# EasyEDA Pro project ProProject_nRF52840无线键盘_2024-02-15.epro, schematic Keys_JLC

## Sheets
1 Keys_JLC
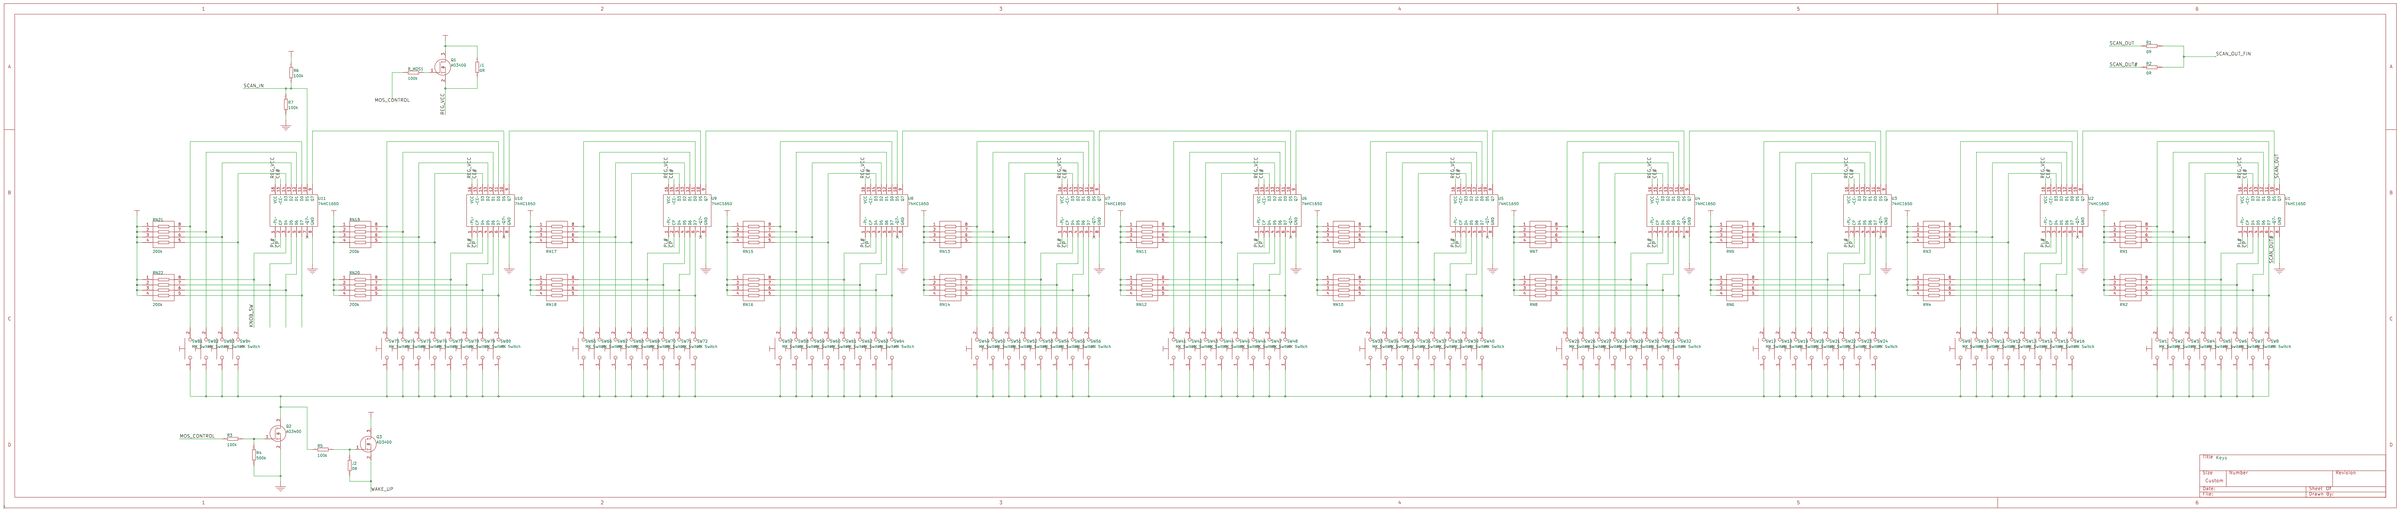
[diagram p6: Keys_JLC]
2 LEDs_JLC
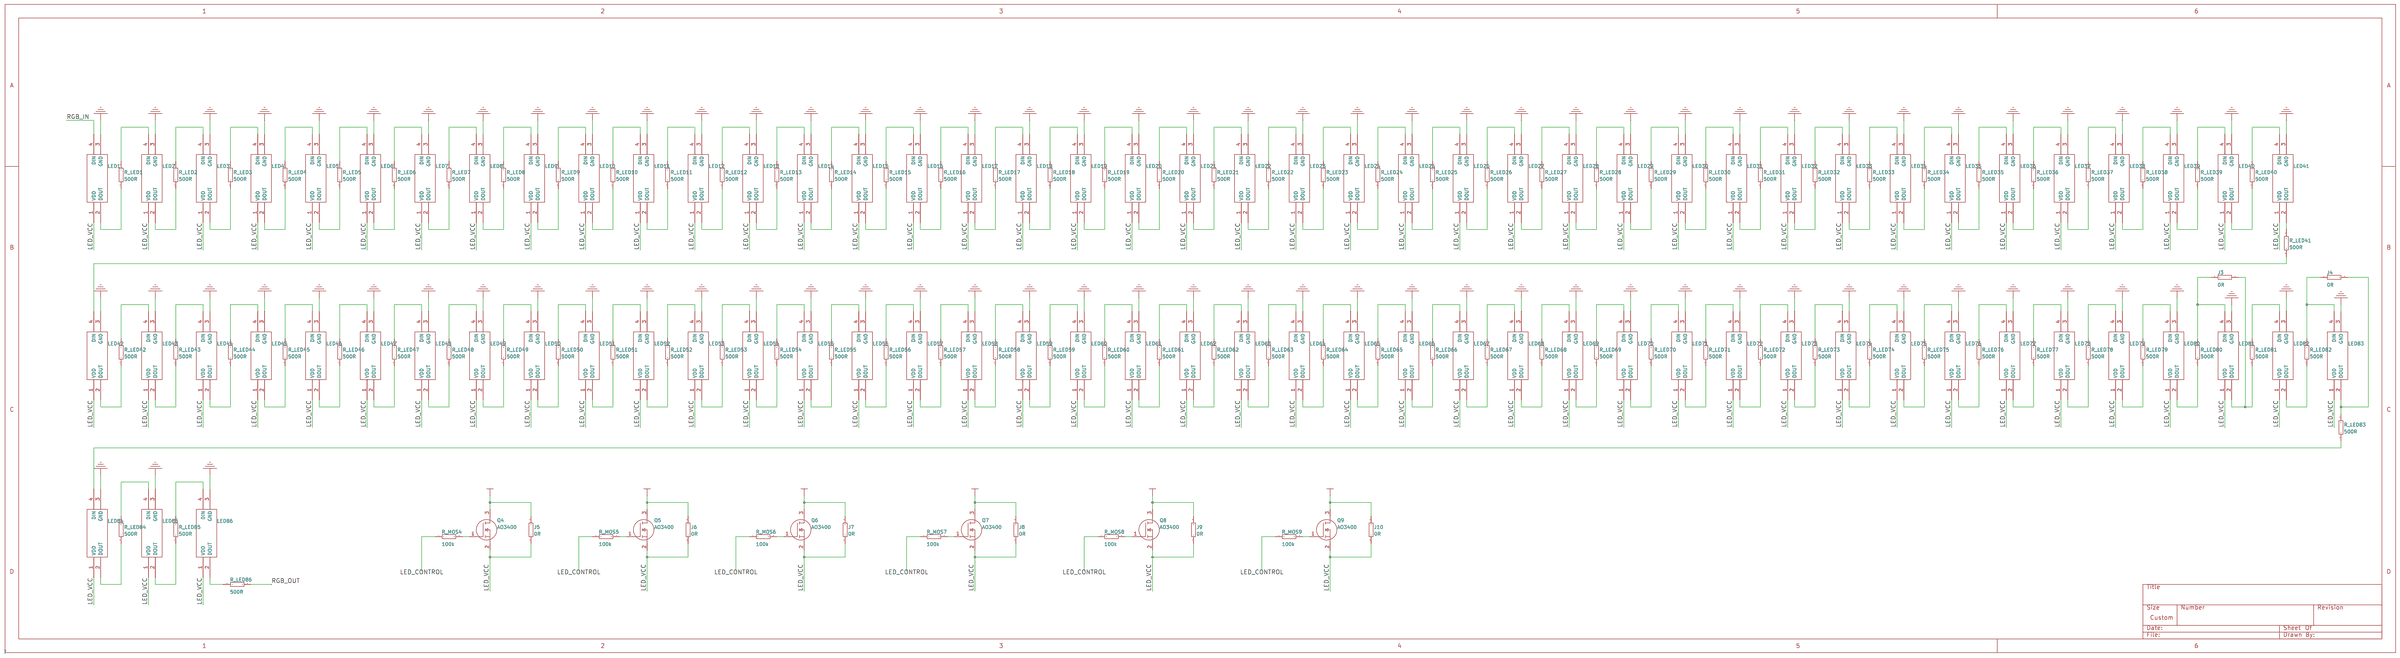
[diagram p7: LEDs_JLC]
3 Other_JLC
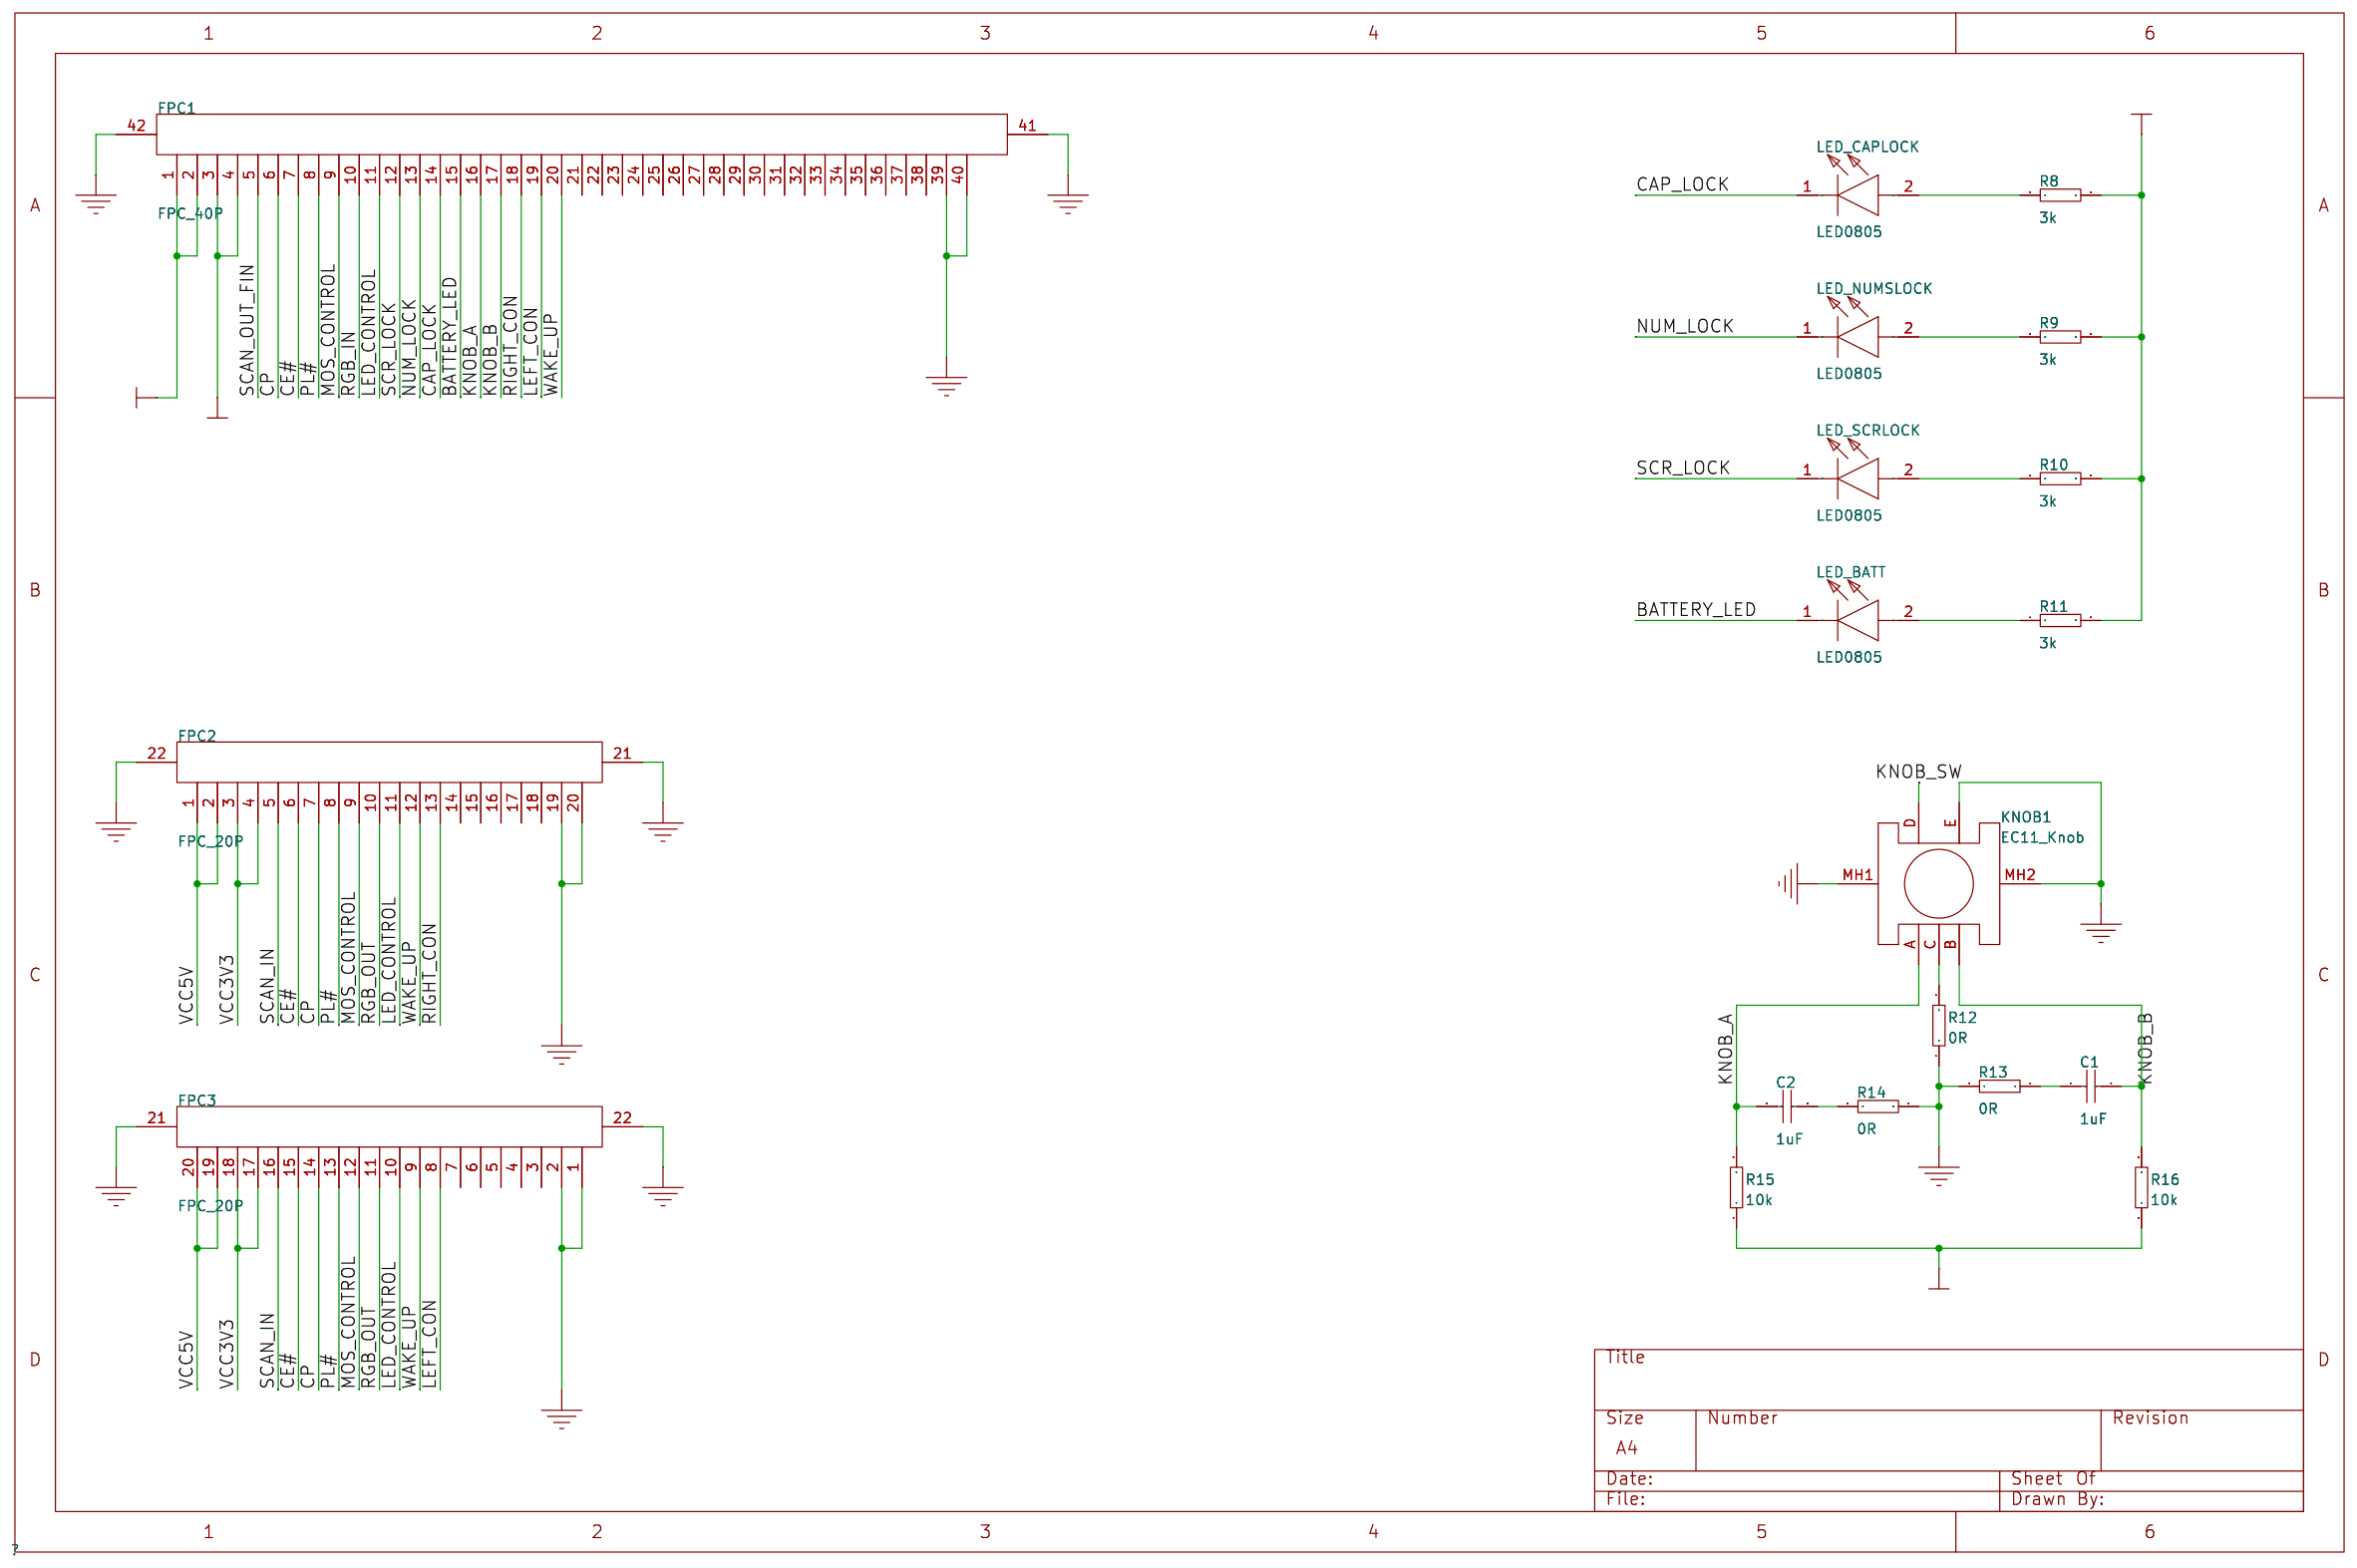
[diagram p8: Other_JLC]

## Parts
sheet Keys_JLC
J1  0R  [0805]
J2  0R  [0805]
Q1  AO3400  [SOT-23-3]
Q2  AO3400  [SOT-23-3]
Q3  AO3400  [SOT-23-3]
R1  0R  [0805]
R2  0R  [0805]
R3  100k  [0805]
R4  500k  [0805]
R5  100k  [0805]
R6  100k  [0805]
R7  100k  [0805]
R_MOS1  100k  [0805]
RN1  排阻  [0603排阻]
RN2  排阻  [0603排阻]
RN3  排阻  [0603排阻]
RN4  排阻  [0603排阻]
RN5  排阻  [0603排阻]
RN6  排阻  [0603排阻]
RN7  排阻  [0603排阻]
RN8  排阻  [0603排阻]
RN9  排阻  [0603排阻]
RN10  排阻  [0603排阻]
RN11  排阻  [0603排阻]
RN12  排阻  [0603排阻]
RN13  排阻  [0603排阻]
RN14  排阻  [0603排阻]
RN15  排阻  [0603排阻]
RN16  排阻  [0603排阻]
RN17  排阻  [0603排阻]
RN18  排阻  [0603排阻]
RN19  200k  [0603排阻]
RN20  200k  [0603排阻]
RN21  200k  [0603排阻]
RN22  200k  [0603排阻]
SW1  MX Switch  [MX-Switch]
SW2  MX Switch  [MX-Switch]
SW3  MX Switch  [MX-Switch]
SW4  MX Switch  [MX-Switch]
SW5  MX Switch  [MX-Switch]
SW6  MX Switch  [MX-Switch]
SW7  MX Switch  [MX-Switch]
SW8  MX Switch  [MX-Switch]
SW9  MX Switch  [MX-Switch]
SW10  MX Switch  [MX-Switch]
SW11  MX Switch  [MX-Switch]
SW12  MX Switch  [MX-Switch]
SW13  MX Switch  [MX-Switch]
SW14  MX Switch  [MX-Switch]
SW15  MX Switch  [MX-Switch]
SW16  MX Switch  [MX-Switch]
SW17  MX Switch  [MX-Switch]
SW18  MX Switch  [MX-Switch]
SW19  MX Switch  [MX-Switch]
SW20  MX Switch  [MX-Switch]
SW21  MX Switch  [MX-Switch]
SW22  MX Switch  [MX-Switch]
SW23  MX Switch  [MX-Switch]
SW24  MX Switch  [MX-Switch]
SW25  MX Switch  [MX-Switch]
SW26  MX Switch  [MX-Switch]
SW27  MX Switch  [MX-Switch]
SW28  MX Switch  [MX-Switch]
SW29  MX Switch  [MX-Switch]
SW30  MX Switch  [MX-Switch]
SW31  MX Switch  [MX-Switch]
SW32  MX Switch  [MX-Switch]
SW33  MX Switch  [MX-Switch]
SW34  MX Switch  [MX-Switch]
SW35  MX Switch  [MX-Switch]
SW36  MX Switch  [MX-Switch]
SW37  MX Switch  [MX-Switch]
SW38  MX Switch  [MX-Switch]
SW39  MX Switch  [MX-Switch]
SW40  MX Switch  [MX-Switch]
SW41  MX Switch  [MX-Switch]
SW42  MX Switch  [MX-Switch]
SW43  MX Switch  [MX-Switch]
SW44  MX Switch  [MX-Switch]
SW45  MX Switch  [MX-Switch]
SW46  MX Switch  [MX-Switch]
SW47  MX Switch  [MX-Switch]
SW48  MX Switch  [MX-Switch]
SW49  MX Switch  [MX-Switch]
SW50  MX Switch  [MX-Switch]
SW51  MX Switch  [MX-Switch]
SW52  MX Switch  [MX-Switch]
SW53  MX Switch  [MX-Switch]
SW54  MX Switch  [MX-Switch]
SW55  MX Switch  [MX-Switch]
SW56  MX Switch  [MX-Switch]
SW57  MX Switch  [MX-Switch]
SW58  MX Switch  [MX-Switch]
SW59  MX Switch  [MX-Switch]
SW60  MX Switch  [MX-Switch]
SW61  MX Switch  [MX-Switch]
SW62  MX Switch  [MX-Switch]
SW63  MX Switch  [MX-Switch]
SW64  MX Switch  [MX-Switch]
SW65  MX Switch  [MX-Switch]
SW66  MX Switch  [MX-Switch]
SW67  MX Switch  [MX-Switch]
SW68  MX Switch  [MX-Switch]
SW69  MX Switch  [MX-Switch]
SW70  MX Switch  [MX-Switch]
SW71  MX Switch  [MX-Switch]
SW72  MX Switch  [MX-Switch]
SW73  MX Switch  [MX-Switch]
SW74  MX Switch  [MX-Switch]
SW75  MX Switch  [MX-Switch]
SW76  MX Switch  [MX-Switch]
SW77  MX Switch  [MX-Switch]
SW78  MX Switch  [MX-Switch]
SW79  MX Switch  [MX-Switch]
SW80  MX Switch  [MX-Switch]
SW81  MX Switch  [MX-Switch]
SW82  MX Switch  [MX-Switch]
SW83  MX Switch  [MX-Switch]
SW84  MX Switch  [MX-Switch]
U1  74HC165D  [SOIC-16]
U2  74HC165D  [SOIC-16]
U3  74HC165D  [SOIC-16]
U4  74HC165D  [SOIC-16]
U5  74HC165D  [SOIC-16]
U6  74HC165D  [SOIC-16]
U7  74HC165D  [SOIC-16]
U8  74HC165D  [SOIC-16]
U9  74HC165D  [SOIC-16]
U10  74HC165D  [SOIC-16]
U11  74HC165D  [SOIC-16]
sheet LEDs_JLC
J3  0R  [0805]
J4  0R  [0805]
J5  0R  [0805]
J6  0R  [0805]
J7  0R  [0805]
J8  0R  [0805]
J9  0R  [0805]
J10  0R  [0805]
LED1  WS2812_3528LED  [WS2812_3528LED]
LED2  WS2812_3528LED  [WS2812_3528LED]
LED3  WS2812_3528LED  [WS2812_3528LED]
LED4  WS2812_3528LED  [WS2812_3528LED]
LED5  WS2812_3528LED  [WS2812_3528LED]
LED6  WS2812_3528LED  [WS2812_3528LED]
LED7  WS2812_3528LED  [WS2812_3528LED]
LED8  WS2812_3528LED  [WS2812_3528LED]
LED9  WS2812_3528LED  [WS2812_3528LED]
LED10  WS2812_3528LED  [WS2812_3528LED]
LED11  WS2812_3528LED  [WS2812_3528LED]
LED12  WS2812_3528LED  [WS2812_3528LED]
LED13  WS2812_3528LED  [WS2812_3528LED]
LED14  WS2812_3528LED  [WS2812_3528LED]
LED15  WS2812_3528LED  [WS2812_3528LED]
LED16  WS2812_3528LED  [WS2812_3528LED]
LED17  WS2812_3528LED  [WS2812_3528LED]
LED18  WS2812_3528LED  [WS2812_3528LED]
LED19  WS2812_3528LED  [WS2812_3528LED]
LED20  WS2812_3528LED  [WS2812_3528LED]
LED21  WS2812_3528LED  [WS2812_3528LED]
LED22  WS2812_3528LED  [WS2812_3528LED]
LED23  WS2812_3528LED  [WS2812_3528LED]
LED24  WS2812_3528LED  [WS2812_3528LED]
LED25  WS2812_3528LED  [WS2812_3528LED]
LED26  WS2812_3528LED  [WS2812_3528LED]
LED27  WS2812_3528LED  [WS2812_3528LED]
LED28  WS2812_3528LED  [WS2812_3528LED]
LED29  WS2812_3528LED  [WS2812_3528LED]
LED30  WS2812_3528LED  [WS2812_3528LED]
LED31  WS2812_3528LED  [WS2812_3528LED]
LED32  WS2812_3528LED  [WS2812_3528LED]
LED33  WS2812_3528LED  [WS2812_3528LED]
LED34  WS2812_3528LED  [WS2812_3528LED]
LED35  WS2812_3528LED  [WS2812_3528LED]
LED36  WS2812_3528LED  [WS2812_3528LED]
LED37  WS2812_3528LED  [WS2812_3528LED]
LED38  WS2812_3528LED  [WS2812_3528LED]
LED39  WS2812_3528LED  [WS2812_3528LED]
LED40  WS2812_3528LED  [WS2812_3528LED]
LED41  WS2812_3528LED  [WS2812_3528LED]
LED42  WS2812_3528LED  [WS2812_3528LED]
LED43  WS2812_3528LED  [WS2812_3528LED]
LED44  WS2812_3528LED  [WS2812_3528LED]
LED45  WS2812_3528LED  [WS2812_3528LED]
LED46  WS2812_3528LED  [WS2812_3528LED]
LED47  WS2812_3528LED  [WS2812_3528LED]
LED48  WS2812_3528LED  [WS2812_3528LED]
LED49  WS2812_3528LED  [WS2812_3528LED]
LED50  WS2812_3528LED  [WS2812_3528LED]
LED51  WS2812_3528LED  [WS2812_3528LED]
LED52  WS2812_3528LED  [WS2812_3528LED]
LED53  WS2812_3528LED  [WS2812_3528LED]
LED54  WS2812_3528LED  [WS2812_3528LED]
LED55  WS2812_3528LED  [WS2812_3528LED]
LED56  WS2812_3528LED  [WS2812_3528LED]
LED57  WS2812_3528LED  [WS2812_3528LED]
LED58  WS2812_3528LED  [WS2812_3528LED]
LED59  WS2812_3528LED  [WS2812_3528LED]
LED60  WS2812_3528LED  [WS2812_3528LED]
LED61  WS2812_3528LED  [WS2812_3528LED]
LED62  WS2812_3528LED  [WS2812_3528LED]
LED63  WS2812_3528LED  [WS2812_3528LED]
LED64  WS2812_3528LED  [WS2812_3528LED]
LED65  WS2812_3528LED  [WS2812_3528LED]
LED66  WS2812_3528LED  [WS2812_3528LED]
LED67  WS2812_3528LED  [WS2812_3528LED]
LED68  WS2812_3528LED  [WS2812_3528LED]
LED69  WS2812_3528LED  [WS2812_3528LED]
LED70  WS2812_3528LED  [WS2812_3528LED]
LED71  WS2812_3528LED  [WS2812_3528LED]
LED72  WS2812_3528LED  [WS2812_3528LED]
LED73  WS2812_3528LED  [WS2812_3528LED]
LED74  WS2812_3528LED  [WS2812_3528LED]
LED75  WS2812_3528LED  [WS2812_3528LED]
LED76  WS2812_3528LED  [WS2812_3528LED]
LED77  WS2812_3528LED  [WS2812_3528LED]
LED78  WS2812_3528LED  [WS2812_3528LED]
LED79  WS2812_3528LED  [WS2812_3528LED]
LED80  WS2812_3528LED  [WS2812_3528LED]
LED81  WS2812_3528LED  [WS2812_3528LED]
LED82  WS2812_3528LED  [WS2812_3528LED]
LED83  WS2812_3528LED  [WS2812_3528LED]
LED84  WS2812_3528LED  [WS2812_3528LED]
LED85  WS2812_3528LED  [WS2812_3528LED]
LED86  WS2812_3528LED  [WS2812_3528LED]
Q4  AO3400  [SOT-23-3]
Q5  AO3400  [SOT-23-3]
Q6  AO3400  [SOT-23-3]
Q7  AO3400  [SOT-23-3]
Q8  AO3400  [SOT-23-3]
Q9  AO3400  [SOT-23-3]
R_LED1  500R  [0805]
R_LED2  500R  [0805]
R_LED3  500R  [0805]
R_LED4  500R  [0805]
R_LED5  500R  [0805]
R_LED6  500R  [0805]
R_LED7  500R  [0805]
R_LED8  500R  [0805]
R_LED9  500R  [0805]
R_LED10  500R  [0805]
R_LED11  500R  [0805]
R_LED12  500R  [0805]
R_LED13  500R  [0805]
R_LED14  500R  [0805]
R_LED15  500R  [0805]
R_LED16  500R  [0805]
R_LED17  500R  [0805]
R_LED18  500R  [0805]
R_LED19  500R  [0805]
R_LED20  500R  [0805]
R_LED21  500R  [0805]
R_LED22  500R  [0805]
R_LED23  500R  [0805]
R_LED24  500R  [0805]
R_LED25  500R  [0805]
R_LED26  500R  [0805]
R_LED27  500R  [0805]
R_LED28  500R  [0805]
R_LED29  500R  [0805]
R_LED30  500R  [0805]
R_LED31  500R  [0805]
R_LED32  500R  [0805]
R_LED33  500R  [0805]
R_LED34  500R  [0805]
R_LED35  500R  [0805]
R_LED36  500R  [0805]
R_LED37  500R  [0805]
R_LED38  500R  [0805]
R_LED39  500R  [0805]
R_LED40  500R  [0805]
R_LED41  500R  [0805]
R_LED42  500R  [0805]
R_LED43  500R  [0805]
R_LED44  500R  [0805]
R_LED45  500R  [0805]
R_LED46  500R  [0805]
R_LED47  500R  [0805]
R_LED48  500R  [0805]
R_LED49  500R  [0805]
R_LED50  500R  [0805]
R_LED51  500R  [0805]
R_LED52  500R  [0805]
R_LED53  500R  [0805]
R_LED54  500R  [0805]
R_LED55  500R  [0805]
R_LED56  500R  [0805]
R_LED57  500R  [0805]
R_LED58  500R  [0805]
R_LED59  500R  [0805]
R_LED60  500R  [0805]
R_LED61  500R  [0805]
R_LED62  500R  [0805]
R_LED63  500R  [0805]
R_LED64  500R  [0805]
R_LED65  500R  [0805]
R_LED66  500R  [0805]
R_LED67  500R  [0805]
R_LED68  500R  [0805]
R_LED69  500R  [0805]
R_LED70  500R  [0805]
R_LED71  500R  [0805]
R_LED72  500R  [0805]
R_LED73  500R  [0805]
R_LED74  500R  [0805]
R_LED75  500R  [0805]
R_LED76  500R  [0805]
R_LED77  500R  [0805]
R_LED78  500R  [0805]
R_LED79  500R  [0805]
R_LED80  500R  [0805]
R_LED81  500R  [0805]
R_LED82  500R  [0805]
R_LED83  500R  [0805]
R_LED84  500R  [0805]
R_LED85  500R  [0805]
R_LED86  500R  [0805]
R_MOS4  100k  [0805]
R_MOS5  100k  [0805]
R_MOS6  100k  [0805]
R_MOS7  100k  [0805]
R_MOS8  100k  [0805]
R_MOS9  100k  [0805]
sheet Other_JLC
C1  1uF  [0805]
C2  1uF  [0805]
FPC1  FPC_40P  [FPC_40P]
FPC2  FPC_20P  [FPC_20P]
FPC3  FPC_20P  [FPC_20P]
KNOB1  EC11_Knob  [EC11]
LED_BATT  LED0805  [LED0805]
LED_CAPLOCK  LED0805  [LED0805]
LED_NUMSLOCK  LED0805  [LED0805]
LED_SCRLOCK  LED0805  [LED0805]
R8  3k  [0805]
R9  3k  [0805]
R10  3k  [0805]
R11  3k  [0805]
R12  0R  [0805]
R13  0R  [0805]
R14  0R  [0805]
R15  10k  [0805]
R16  10k  [0805]

## Library data of the parts
J1-J10 R1-R16 R_LED1-R_LED86 R_MOS1 R_MOS4-R_MOS9 = Resistor: Library Name: Brian_Integrated_Lib
Q1-Q9 = AO3400: MOSFET (N-Channel); Datasheet Link: https://www.infineon.com/dgdl/irlml6344pbf.pdf?fileId=5546d462533600a4015356689c44262c; Height: 1.12mm; Manufacturer_Name: Infineon; Manufacturer_Part_Number: IRLML6344TRPBF; Mouser Part Number: 942-IRLML6344TRPBF; Mouser Price/Stock: https://www.mouser.co.uk/ProductDetail/Infineon-Technologies/IRLML6344TRPBF?qs=9%252BKlkBgLFf2w4qS48UOXVw%3D%3D; Arrow Part Number: IRLML6344TRPBF; Arrow Price/Stock: https://www.arrow.com/en/products/irlml6344trpbf/infineon-technologies-ag?region=europe; Library Name: Brian_Integrated_Lib
RN1-RN22 = 排阻: Resistor Network; Datasheet Link: https://industrial.panasonic.com/cdbs/www-data/pdf/AOC0000/AOC0000C14.pdf; Height: 0mm; Manufacturer_Name: Panasonic; Manufacturer_Part_Number: EXB-V8V152JV; Mouser Part Number: 667-EXB-V8V152JV; Mouser Price/Stock: https://www.mouser.co.uk/ProductDetail/Panasonic/EXB-V8V152JV?qs=uA7cY%2Fh6FfU1uZhF3xaZgw%3D%3D; Arrow Part Number: EXB-V8V152JV; Arrow Price/Stock: https://www.arrow.com/en/products/exb-v8v152jv/panasonic?region=europe; Library Name: Brian_Integrated_Lib
SW1-SW84 = MX Switch: MX Keyboard Switch; Library Name: Brian_Integrated_Lib
U1-U11 = 74HC165D: Integrated Circuit; Datasheet Link: http://uk.rs-online.com/web/p/products/1776629P; Height: 1.75mm; RS Part Number: 1776629P; RS Price/Stock: http://uk.rs-online.com/web/p/products/1776629P; Manufacturer_Name: Nexperia; Manufacturer_Part_Number: 74HC165D,652; Library Name: Brian_Integrated_Lib
LED1-LED86 = WS2812_3528LED: Library Name: Brian_Integrated_Lib
C1 C2 = Capacitor: Library Name: Brian_Integrated_Lib
FPC1 = FPC_40P: 40P FPC Connector; Library Name: Brian_Integrated_Lib
FPC2 FPC3 = FPC_20P: 20P FPC Connector; Library Name: Brian_Integrated_Lib
KNOB1 = EC11_Knob: EC11 Knob; Datasheet Link: https://www.bourns.com/docs/product-datasheets/pec11r.pdf?sfvrsn=bb617cbf_12; Height: 21.5mm; Manufacturer_Name: Bourns; Manufacturer_Part_Number: PEC11R-4215F-S0024; Mouser Part Number: 652-PEC11R-4215F-S24; Mouser Price/Stock: https://www.mouser.co.uk/ProductDetail/Bourns/PEC11R-4215F-S0024?qs=Zq5ylnUbLm5lAqmKF80wzQ%3D%3D; Arrow Part Number: PEC11R-4215F-S0024; Arrow Price/Stock: https://www.arrow.com/en/products/pec11r-4215f-s0024/bourns?region=europe; Library Name: Brian_Integrated_Lib
LED_BATT LED_CAPLOCK LED_NUMSLOCK LED_SCRLOCK = LED0805: LED 0805; Datasheet Link: https://katalog.we-online.com/led/datasheet/150080BS75000.pdf; Height: 0.8mm; Manufacturer_Name: Wurth Elektronik; Manufacturer_Part_Number: 150080BS75000; Mouser Part Number: 710-150080BS75000; Mouser Price/Stock: https://www.mouser.co.uk/ProductDetail/Wurth-Elektronik/150080BS75000?qs=2kOmHSv6VfT2tBo3UPVqAQ%3D%3D; Library Name: Brian_Integrated_Lib

## Nets
GND: FPC1.39 FPC1.40 FPC1.41 FPC1.42 FPC2.19 FPC2.20 FPC2.21 FPC2.22 FPC3.1 FPC3.2 FPC3.21 FPC3.22 KNOB1.E KNOB1.MH1 KNOB1.MH2 LED1.3(GND) LED2.3(GND) LED3.3(GND) LED4.3(GND) LED5.3(GND) LED6.3(GND) LED7.3(GND) LED8.3(GND) LED9.3(GND) LED10.3(GND) LED11.3(GND) LED12.3(GND) LED13.3(GND) LED14.3(GND) LED15.3(GND) LED16.3(GND) LED17.3(GND) LED18.3(GND) LED19.3(GND) LED20.3(GND) LED21.3(GND) LED22.3(GND) LED23.3(GND) LED24.3(GND) LED25.3(GND) LED26.3(GND) LED27.3(GND) LED28.3(GND) LED29.3(GND) LED30.3(GND) LED31.3(GND) LED32.3(GND) LED33.3(GND) LED34.3(GND) LED35.3(GND) LED36.3(GND) LED37.3(GND) LED38.3(GND) LED39.3(GND) LED40.3(GND) LED41.3(GND) LED42.3(GND) LED43.3(GND) LED44.3(GND) LED45.3(GND) LED46.3(GND) LED47.3(GND) LED48.3(GND) LED49.3(GND) LED50.3(GND) LED51.3(GND) LED52.3(GND) LED53.3(GND) LED54.3(GND) LED55.3(GND) LED56.3(GND) LED57.3(GND) LED58.3(GND) LED59.3(GND) LED60.3(GND) LED61.3(GND) LED62.3(GND) LED63.3(GND) LED64.3(GND) LED65.3(GND) LED66.3(GND) LED67.3(GND) LED68.3(GND) LED69.3(GND) LED70.3(GND) LED71.3(GND) LED72.3(GND) LED73.3(GND) LED74.3(GND) LED75.3(GND) LED76.3(GND) LED77.3(GND) LED78.3(GND) LED79.3(GND) LED80.3(GND) LED81.3(GND) LED82.3(GND) LED83.3(GND) LED84.3(GND) LED85.3(GND) LED86.3(GND) Q2.2(S) R4.1 R7.1 R12.1 R13.2 R14.1 U1.8(GND) U2.8(GND) U3.8(GND) U4.8(GND) U5.8(GND) U6.8(GND) U7.8(GND) U8.8(GND) U9.8(GND) U10.8(GND) U11.8(GND)
VCC3V3: FPC1.3 FPC1.4 FPC2.3 FPC2.4 FPC3.17 FPC3.18 J1.2 Q1.3(D) Q3.3(D) R6.2 R8.2 R9.2 R10.2 R11.2 R15.1 R16.1 RN1.1 RN1.2 RN1.3 RN1.4 RN2.1 RN2.2 RN2.3 RN2.4 RN3.1 RN3.2 RN3.3 RN3.4 RN4.1 RN4.2 RN4.3 RN4.4 RN5.1 RN5.2 RN5.3 RN5.4 RN6.1 RN6.2 RN6.3 RN6.4 RN7.1 RN7.2 RN7.3 RN7.4 RN8.1 RN8.2 RN8.3 RN8.4 RN9.1 RN9.2 RN9.3 RN9.4 RN10.1 RN10.2 RN10.3 RN10.4 RN11.1 RN11.2 RN11.3 RN11.4 RN12.1 RN12.2 RN12.3 RN12.4 RN13.1 RN13.2 RN13.3 RN13.4 RN14.1 RN14.2 RN14.3 RN14.4 RN15.1 RN15.2 RN15.3 RN15.4 RN16.1 RN16.2 RN16.3 RN16.4 RN17.1 RN17.2 RN17.3 RN17.4 RN18.1 RN18.2 RN18.3 RN18.4 RN19.1 RN19.2 RN19.3 RN19.4 RN20.1 RN20.2 RN20.3 RN20.4 RN21.1 RN21.2 RN21.3 RN21.4 RN22.1 RN22.2 RN22.3 RN22.4
VCC5V: FPC1.1 FPC1.2 FPC2.1 FPC2.2 FPC3.19 FPC3.20 J5.2 J6.2 J7.2 J8.2 J9.2 J10.2 Q4.3(D) Q5.3(D) Q6.3(D) Q7.3(D) Q8.3(D) Q9.3(D)
BATTERY_LED: FPC1.15 LED_BATT.1(K)
CAP_LOCK: FPC1.14 LED_CAPLOCK.1(K)
CE#: FPC1.7 FPC2.6 FPC3.15 U1.15(~CE~) U2.15(~CE~) U3.15(~CE~) U4.15(~CE~) U5.15(~CE~) U6.15(~CE~) U7.15(~CE~) U8.15(~CE~) U9.15(~CE~) U10.15(~CE~) U11.15(~CE~)
CP: FPC1.6 FPC2.7 FPC3.14 U1.2(CP) U2.2(CP) U3.2(CP) U4.2(CP) U5.2(CP) U6.2(CP) U7.2(CP) U8.2(CP) U9.2(CP) U10.2(CP) U11.2(CP)
KNOB_A: C2.1 FPC1.16 KNOB1.A R15.2
KNOB_B: C1.2 FPC1.17 KNOB1.B R16.2
KNOB_SW: KNOB1.D RN22.8 U11.3(D4)
LED_CONTROL: FPC1.11 FPC2.11 FPC3.10 R_MOS4.1 R_MOS5.1 R_MOS6.1 R_MOS7.1 R_MOS8.1 R_MOS9.1
LED_VCC: J5.1 J6.1 J7.1 J8.1 J9.1 J10.1 LED1.1(VDD) LED2.1(VDD) LED3.1(VDD) LED4.1(VDD) LED5.1(VDD) LED6.1(VDD) LED7.1(VDD) LED8.1(VDD) LED9.1(VDD) LED10.1(VDD) LED11.1(VDD) LED12.1(VDD) LED13.1(VDD) LED14.1(VDD) LED15.1(VDD) LED16.1(VDD) LED17.1(VDD) LED18.1(VDD) LED19.1(VDD) LED20.1(VDD) LED21.1(VDD) LED22.1(VDD) LED23.1(VDD) LED24.1(VDD) LED25.1(VDD) LED26.1(VDD) LED27.1(VDD) LED28.1(VDD) LED29.1(VDD) LED30.1(VDD) LED31.1(VDD) LED32.1(VDD) LED33.1(VDD) LED34.1(VDD) LED35.1(VDD) LED36.1(VDD) LED37.1(VDD) LED38.1(VDD) LED39.1(VDD) LED40.1(VDD) LED41.1(VDD) LED42.1(VDD) LED43.1(VDD) LED44.1(VDD) LED45.1(VDD) LED46.1(VDD) LED47.1(VDD) LED48.1(VDD) LED49.1(VDD) LED50.1(VDD) LED51.1(VDD) LED52.1(VDD) LED53.1(VDD) LED54.1(VDD) LED55.1(VDD) LED56.1(VDD) LED57.1(VDD) LED58.1(VDD) LED59.1(VDD) LED60.1(VDD) LED61.1(VDD) LED62.1(VDD) LED63.1(VDD) LED64.1(VDD) LED65.1(VDD) LED66.1(VDD) LED67.1(VDD) LED68.1(VDD) LED69.1(VDD) LED70.1(VDD) LED71.1(VDD) LED72.1(VDD) LED73.1(VDD) LED74.1(VDD) LED75.1(VDD) LED76.1(VDD) LED77.1(VDD) LED78.1(VDD) LED79.1(VDD) LED80.1(VDD) LED81.1(VDD) LED82.1(VDD) LED83.1(VDD) LED84.1(VDD) LED85.1(VDD) LED86.1(VDD) Q4.2(S) Q5.2(S) Q6.2(S) Q7.2(S) Q8.2(S) Q9.2(S)
LEFT_CON: FPC1.19 FPC3.8
MOS_CONTROL: FPC1.9 FPC2.9 FPC3.12 R3.2 R_MOS1.1
NUM_LOCK: FPC1.13 LED_NUMSLOCK.1(K)
PL#: FPC1.8 FPC2.8 FPC3.13 U1.1(~PL~) U2.1(~PL~) U3.1(~PL~) U4.1(~PL~) U5.1(~PL~) U6.1(~PL~) U7.1(~PL~) U8.1(~PL~) U9.1(~PL~) U10.1(~PL~) U11.1(~PL~)
REG_VCC: J1.1 Q1.2(S) U1.16(VCC) U2.16(VCC) U3.16(VCC) U4.16(VCC) U5.16(VCC) U6.16(VCC) U7.16(VCC) U8.16(VCC) U9.16(VCC) U10.16(VCC) U11.16(VCC)
RGB_IN: FPC1.10 LED1.4(DIN)
RGB_OUT: FPC2.10 FPC3.11 R_LED86.1
RIGHT_CON: FPC1.18 FPC2.13
SCAN_IN: FPC2.5 FPC3.16 R6.1 R7.2 U11.10(DS)
SCAN_OUT: R1.1 U1.9(Q7)
SCAN_OUT#: R2.1 U1.7(~Q7~)
SCAN_OUT_FIN: FPC1.5 R1.2 R2.2
SCR_LOCK: FPC1.12 LED_SCRLOCK.1(K)
WAKE_UP: FPC1.20 FPC2.12 FPC3.9 J2.2 Q3.2(S)
NETC1_1: C1.1 R13.1
NETC2_2: C2.2 R14.2
NETJ2_1: J2.1 Q3.1(G) R5.1
NETJ3_1: J3.1 LED81.2(DOUT) R_LED81.1
NETJ3_2: J3.2 LED81.4(DIN) R_LED80.2
NETJ4_1: J4.1 LED83.4(DIN) R_LED82.2
NETJ4_2: J4.2 LED83.2(DOUT) R_LED83.2
NETKNOB1_C: KNOB1.C R12.2
NETLED1_2: LED1.2(DOUT) R_LED1.1
NETLED2_2: LED2.2(DOUT) R_LED2.1
NETLED2_4: LED2.4(DIN) R_LED1.2
NETLED3_2: LED3.2(DOUT) R_LED3.1
NETLED3_4: LED3.4(DIN) R_LED2.2
NETLED4_2: LED4.2(DOUT) R_LED4.1
NETLED4_4: LED4.4(DIN) R_LED3.2
NETLED5_2: LED5.2(DOUT) R_LED5.1
NETLED5_4: LED5.4(DIN) R_LED4.2
NETLED6_2: LED6.2(DOUT) R_LED6.1
NETLED6_4: LED6.4(DIN) R_LED5.2
NETLED7_2: LED7.2(DOUT) R_LED7.1
NETLED7_4: LED7.4(DIN) R_LED6.2
NETLED8_2: LED8.2(DOUT) R_LED8.1
NETLED8_4: LED8.4(DIN) R_LED7.2
NETLED9_2: LED9.2(DOUT) R_LED9.1
NETLED9_4: LED9.4(DIN) R_LED8.2
NETLED10_2: LED10.2(DOUT) R_LED10.1
NETLED10_4: LED10.4(DIN) R_LED9.2
NETLED11_2: LED11.2(DOUT) R_LED11.1
NETLED11_4: LED11.4(DIN) R_LED10.2
NETLED12_2: LED12.2(DOUT) R_LED12.1
NETLED12_4: LED12.4(DIN) R_LED11.2
NETLED13_2: LED13.2(DOUT) R_LED13.1
NETLED13_4: LED13.4(DIN) R_LED12.2
NETLED14_2: LED14.2(DOUT) R_LED14.1
NETLED14_4: LED14.4(DIN) R_LED13.2
NETLED15_2: LED15.2(DOUT) R_LED15.1
NETLED15_4: LED15.4(DIN) R_LED14.2
NETLED16_2: LED16.2(DOUT) R_LED16.1
NETLED16_4: LED16.4(DIN) R_LED15.2
NETLED17_2: LED17.2(DOUT) R_LED17.1
NETLED17_4: LED17.4(DIN) R_LED16.2
NETLED18_2: LED18.2(DOUT) R_LED18.1
NETLED18_4: LED18.4(DIN) R_LED17.2
NETLED19_2: LED19.2(DOUT) R_LED19.1
NETLED19_4: LED19.4(DIN) R_LED18.2
NETLED20_2: LED20.2(DOUT) R_LED20.1
NETLED20_4: LED20.4(DIN) R_LED19.2
NETLED21_2: LED21.2(DOUT) R_LED21.1
NETLED21_4: LED21.4(DIN) R_LED20.2
NETLED22_2: LED22.2(DOUT) R_LED22.1
NETLED22_4: LED22.4(DIN) R_LED21.2
NETLED23_2: LED23.2(DOUT) R_LED23.1
NETLED23_4: LED23.4(DIN) R_LED22.2
NETLED24_2: LED24.2(DOUT) R_LED24.1
NETLED24_4: LED24.4(DIN) R_LED23.2
NETLED25_2: LED25.2(DOUT) R_LED25.1
NETLED25_4: LED25.4(DIN) R_LED24.2
NETLED26_2: LED26.2(DOUT) R_LED26.1
NETLED26_4: LED26.4(DIN) R_LED25.2
NETLED27_2: LED27.2(DOUT) R_LED27.1
NETLED27_4: LED27.4(DIN) R_LED26.2
NETLED28_2: LED28.2(DOUT) R_LED28.1
NETLED28_4: LED28.4(DIN) R_LED27.2
NETLED29_2: LED29.2(DOUT) R_LED29.1
NETLED29_4: LED29.4(DIN) R_LED28.2
NETLED30_2: LED30.2(DOUT) R_LED30.1
NETLED30_4: LED30.4(DIN) R_LED29.2
NETLED31_2: LED31.2(DOUT) R_LED31.1
NETLED31_4: LED31.4(DIN) R_LED30.2
NETLED32_2: LED32.2(DOUT) R_LED32.1
NETLED32_4: LED32.4(DIN) R_LED31.2
NETLED33_2: LED33.2(DOUT) R_LED33.1
NETLED33_4: LED33.4(DIN) R_LED32.2
NETLED34_2: LED34.2(DOUT) R_LED34.1
NETLED34_4: LED34.4(DIN) R_LED33.2
NETLED35_2: LED35.2(DOUT) R_LED35.1
NETLED35_4: LED35.4(DIN) R_LED34.2
NETLED36_2: LED36.2(DOUT) R_LED36.1
NETLED36_4: LED36.4(DIN) R_LED35.2
NETLED37_2: LED37.2(DOUT) R_LED37.1
NETLED37_4: LED37.4(DIN) R_LED36.2
NETLED38_2: LED38.2(DOUT) R_LED38.1
NETLED38_4: LED38.4(DIN) R_LED37.2
NETLED39_2: LED39.2(DOUT) R_LED39.1
NETLED39_4: LED39.4(DIN) R_LED38.2
NETLED40_2: LED40.2(DOUT) R_LED40.1
NETLED40_4: LED40.4(DIN) R_LED39.2
NETLED41_2: LED41.2(DOUT) R_LED41.1
NETLED41_4: LED41.4(DIN) R_LED40.2
NETLED42_2: LED42.2(DOUT) R_LED42.1
NETLED42_4: LED42.4(DIN) R_LED41.2
NETLED43_2: LED43.2(DOUT) R_LED43.1
NETLED43_4: LED43.4(DIN) R_LED42.2
NETLED44_2: LED44.2(DOUT) R_LED44.1
NETLED44_4: LED44.4(DIN) R_LED43.2
NETLED45_2: LED45.2(DOUT) R_LED45.1
NETLED45_4: LED45.4(DIN) R_LED44.2
NETLED46_2: LED46.2(DOUT) R_LED46.1
NETLED46_4: LED46.4(DIN) R_LED45.2
NETLED47_2: LED47.2(DOUT) R_LED47.1
NETLED47_4: LED47.4(DIN) R_LED46.2
NETLED48_2: LED48.2(DOUT) R_LED48.1
NETLED48_4: LED48.4(DIN) R_LED47.2
NETLED49_2: LED49.2(DOUT) R_LED49.1
NETLED49_4: LED49.4(DIN) R_LED48.2
NETLED50_2: LED50.2(DOUT) R_LED50.1
NETLED50_4: LED50.4(DIN) R_LED49.2
NETLED51_2: LED51.2(DOUT) R_LED51.1
NETLED51_4: LED51.4(DIN) R_LED50.2
NETLED52_2: LED52.2(DOUT) R_LED52.1
NETLED52_4: LED52.4(DIN) R_LED51.2
NETLED53_2: LED53.2(DOUT) R_LED53.1
NETLED53_4: LED53.4(DIN) R_LED52.2
NETLED54_2: LED54.2(DOUT) R_LED54.1
NETLED54_4: LED54.4(DIN) R_LED53.2
NETLED55_2: LED55.2(DOUT) R_LED55.1
NETLED55_4: LED55.4(DIN) R_LED54.2
NETLED56_2: LED56.2(DOUT) R_LED56.1
NETLED56_4: LED56.4(DIN) R_LED55.2
NETLED57_2: LED57.2(DOUT) R_LED57.1
NETLED57_4: LED57.4(DIN) R_LED56.2
NETLED58_2: LED58.2(DOUT) R_LED58.1
NETLED58_4: LED58.4(DIN) R_LED57.2
NETLED59_2: LED59.2(DOUT) R_LED59.1
NETLED59_4: LED59.4(DIN) R_LED58.2
NETLED60_2: LED60.2(DOUT) R_LED60.1
NETLED60_4: LED60.4(DIN) R_LED59.2
NETLED61_2: LED61.2(DOUT) R_LED61.1
NETLED61_4: LED61.4(DIN) R_LED60.2
NETLED62_2: LED62.2(DOUT) R_LED62.1
NETLED62_4: LED62.4(DIN) R_LED61.2
NETLED63_2: LED63.2(DOUT) R_LED63.1
NETLED63_4: LED63.4(DIN) R_LED62.2
NETLED64_2: LED64.2(DOUT) R_LED64.1
NETLED64_4: LED64.4(DIN) R_LED63.2
NETLED65_2: LED65.2(DOUT) R_LED65.1
NETLED65_4: LED65.4(DIN) R_LED64.2
NETLED66_2: LED66.2(DOUT) R_LED66.1
NETLED66_4: LED66.4(DIN) R_LED65.2
NETLED67_2: LED67.2(DOUT) R_LED67.1
NETLED67_4: LED67.4(DIN) R_LED66.2
NETLED68_2: LED68.2(DOUT) R_LED68.1
NETLED68_4: LED68.4(DIN) R_LED67.2
NETLED69_2: LED69.2(DOUT) R_LED69.1
NETLED69_4: LED69.4(DIN) R_LED68.2
NETLED70_2: LED70.2(DOUT) R_LED70.1
NETLED70_4: LED70.4(DIN) R_LED69.2
NETLED71_2: LED71.2(DOUT) R_LED71.1
NETLED71_4: LED71.4(DIN) R_LED70.2
NETLED72_2: LED72.2(DOUT) R_LED72.1
NETLED72_4: LED72.4(DIN) R_LED71.2
NETLED73_2: LED73.2(DOUT) R_LED73.1
NETLED73_4: LED73.4(DIN) R_LED72.2
NETLED74_2: LED74.2(DOUT) R_LED74.1
NETLED74_4: LED74.4(DIN) R_LED73.2
NETLED75_2: LED75.2(DOUT) R_LED75.1
NETLED75_4: LED75.4(DIN) R_LED74.2
NETLED76_2: LED76.2(DOUT) R_LED76.1
NETLED76_4: LED76.4(DIN) R_LED75.2
NETLED77_2: LED77.2(DOUT) R_LED77.1
NETLED77_4: LED77.4(DIN) R_LED76.2
NETLED78_2: LED78.2(DOUT) R_LED78.1
NETLED78_4: LED78.4(DIN) R_LED77.2
NETLED79_2: LED79.2(DOUT) R_LED79.1
NETLED79_4: LED79.4(DIN) R_LED78.2
NETLED80_2: LED80.2(DOUT) R_LED80.1
NETLED80_4: LED80.4(DIN) R_LED79.2
NETLED82_2: LED82.2(DOUT) R_LED82.1
NETLED82_4: LED82.4(DIN) R_LED81.2
NETLED84_2: LED84.2(DOUT) R_LED84.1
NETLED84_4: LED84.4(DIN) R_LED83.1
NETLED85_2: LED85.2(DOUT) R_LED85.1
NETLED85_4: LED85.4(DIN) R_LED84.2
NETLED86_2: LED86.2(DOUT) R_LED86.2
NETLED86_4: LED86.4(DIN) R_LED85.2
NETLED_BATT_2: LED_BATT.2(A) R11.1
NETLED_CAPLOCK_2: LED_CAPLOCK.2(A) R8.1
NETLED_NUMSLOCK_2: LED_NUMSLOCK.2(A) R9.1
NETLED_SCRLOCK_2: LED_SCRLOCK.2(A) R10.1
NETQ1_1: Q1.1(G) R_MOS1.2
NETQ2_1: Q2.1(G) R3.1 R4.2
NETQ2_3: Q2.3(D) R5.2 SW1.1(2) SW2.1(2) SW3.1(2) SW4.1(2) SW5.1(2) SW6.1(2) SW7.1(2) SW8.1(2) SW9.1(2) SW10.1(2) SW11.1(2) SW12.1(2) SW13.1(2) SW14.1(2) SW15.1(2) SW16.1(2) SW17.1(2) SW18.1(2) SW19.1(2) SW20.1(2) SW21.1(2) SW22.1(2) SW23.1(2) SW24.1(2) SW25.1(2) SW26.1(2) SW27.1(2) SW28.1(2) SW29.1(2) SW30.1(2) SW31.1(2) SW32.1(2) SW33.1(2) SW34.1(2) SW35.1(2) SW36.1(2) SW37.1(2) SW38.1(2) SW39.1(2) SW40.1(2) SW41.1(2) SW42.1(2) SW43.1(2) SW44.1(2) SW45.1(2) SW46.1(2) SW47.1(2) SW48.1(2) SW49.1(2) SW50.1(2) SW51.1(2) SW52.1(2) SW53.1(2) SW54.1(2) SW55.1(2) SW56.1(2) SW57.1(2) SW58.1(2) SW59.1(2) SW60.1(2) SW61.1(2) SW62.1(2) SW63.1(2) SW64.1(2) SW65.1(2) SW66.1(2) SW67.1(2) SW68.1(2) SW69.1(2) SW70.1(2) SW71.1(2) SW72.1(2) SW73.1(2) SW74.1(2) SW75.1(2) SW76.1(2) SW77.1(2) SW78.1(2) SW79.1(2) SW80.1(2) SW81.1(2) SW82.1(2) SW83.1(2) SW84.1(2)
NETQ4_1: Q4.1(G) R_MOS4.2
NETQ5_1: Q5.1(G) R_MOS5.2
NETQ6_1: Q6.1(G) R_MOS6.2
NETQ7_1: Q7.1(G) R_MOS7.2
NETQ8_1: Q8.1(G) R_MOS8.2
NETQ9_1: Q9.1(G) R_MOS9.2
NETRN1_5: RN1.5 SW4.2 U1.14(D3)
NETRN1_6: RN1.6 SW3.2 U1.13(D2)
NETRN1_7: RN1.7 SW2.2 U1.12(D1)
NETRN1_8: RN1.8 SW1.2 U1.11(D0)
NETRN2_5: RN2.5 SW8.2 U1.6(D7)
NETRN2_6: RN2.6 SW7.2 U1.5(D6)
NETRN2_7: RN2.7 SW6.2 U1.4(D5)
NETRN2_8: RN2.8 SW5.2 U1.3(D4)
NETRN3_5: RN3.5 SW12.2 U2.14(D3)
NETRN3_6: RN3.6 SW11.2 U2.13(D2)
NETRN3_7: RN3.7 SW10.2 U2.12(D1)
NETRN3_8: RN3.8 SW9.2 U2.11(D0)
NETRN4_5: RN4.5 SW16.2 U2.6(D7)
NETRN4_6: RN4.6 SW15.2 U2.5(D6)
NETRN4_7: RN4.7 SW14.2 U2.4(D5)
NETRN4_8: RN4.8 SW13.2 U2.3(D4)
NETRN5_5: RN5.5 SW20.2 U3.14(D3)
NETRN5_6: RN5.6 SW19.2 U3.13(D2)
NETRN5_7: RN5.7 SW18.2 U3.12(D1)
NETRN5_8: RN5.8 SW17.2 U3.11(D0)
NETRN6_5: RN6.5 SW24.2 U3.6(D7)
NETRN6_6: RN6.6 SW23.2 U3.5(D6)
NETRN6_7: RN6.7 SW22.2 U3.4(D5)
NETRN6_8: RN6.8 SW21.2 U3.3(D4)
NETRN7_5: RN7.5 SW28.2 U4.14(D3)
NETRN7_6: RN7.6 SW27.2 U4.13(D2)
NETRN7_7: RN7.7 SW26.2 U4.12(D1)
NETRN7_8: RN7.8 SW25.2 U4.11(D0)
NETRN8_5: RN8.5 SW32.2 U4.6(D7)
NETRN8_6: RN8.6 SW31.2 U4.5(D6)
NETRN8_7: RN8.7 SW30.2 U4.4(D5)
NETRN8_8: RN8.8 SW29.2 U4.3(D4)
NETRN9_5: RN9.5 SW36.2 U5.14(D3)
NETRN9_6: RN9.6 SW35.2 U5.13(D2)
NETRN9_7: RN9.7 SW34.2 U5.12(D1)
NETRN9_8: RN9.8 SW33.2 U5.11(D0)
NETRN10_5: RN10.5 SW40.2 U5.6(D7)
NETRN10_6: RN10.6 SW39.2 U5.5(D6)
NETRN10_7: RN10.7 SW38.2 U5.4(D5)
NETRN10_8: RN10.8 SW37.2 U5.3(D4)
NETRN11_5: RN11.5 SW44.2 U6.14(D3)
NETRN11_6: RN11.6 SW43.2 U6.13(D2)
NETRN11_7: RN11.7 SW42.2 U6.12(D1)
NETRN11_8: RN11.8 SW41.2 U6.11(D0)
NETRN12_5: RN12.5 SW48.2 U6.6(D7)
NETRN12_6: RN12.6 SW47.2 U6.5(D6)
NETRN12_7: RN12.7 SW46.2 U6.4(D5)
NETRN12_8: RN12.8 SW45.2 U6.3(D4)
NETRN13_5: RN13.5 SW52.2 U7.14(D3)
NETRN13_6: RN13.6 SW51.2 U7.13(D2)
NETRN13_7: RN13.7 SW50.2 U7.12(D1)
NETRN13_8: RN13.8 SW49.2 U7.11(D0)
NETRN14_5: RN14.5 SW56.2 U7.6(D7)
NETRN14_6: RN14.6 SW55.2 U7.5(D6)
NETRN14_7: RN14.7 SW54.2 U7.4(D5)
NETRN14_8: RN14.8 SW53.2 U7.3(D4)
NETRN15_5: RN15.5 SW60.2 U8.14(D3)
NETRN15_6: RN15.6 SW59.2 U8.13(D2)
NETRN15_7: RN15.7 SW58.2 U8.12(D1)
NETRN15_8: RN15.8 SW57.2 U8.11(D0)
NETRN16_5: RN16.5 SW64.2 U8.6(D7)
NETRN16_6: RN16.6 SW63.2 U8.5(D6)
NETRN16_7: RN16.7 SW62.2 U8.4(D5)
NETRN16_8: RN16.8 SW61.2 U8.3(D4)
NETRN17_5: RN17.5 SW68.2 U9.14(D3)
NETRN17_6: RN17.6 SW67.2 U9.13(D2)
NETRN17_7: RN17.7 SW66.2 U9.12(D1)
NETRN17_8: RN17.8 SW65.2 U9.11(D0)
NETRN18_5: RN18.5 SW72.2 U9.6(D7)
NETRN18_6: RN18.6 SW71.2 U9.5(D6)
NETRN18_7: RN18.7 SW70.2 U9.4(D5)
NETRN18_8: RN18.8 SW69.2 U9.3(D4)
NETRN19_5: RN19.5 SW76.2 U10.14(D3)
NETRN19_6: RN19.6 SW75.2 U10.13(D2)
NETRN19_7: RN19.7 SW74.2 U10.12(D1)
NETRN19_8: RN19.8 SW73.2 U10.11(D0)
NETRN20_5: RN20.5 SW80.2 U10.6(D7)
NETRN20_6: RN20.6 SW79.2 U10.5(D6)
NETRN20_7: RN20.7 SW78.2 U10.4(D5)
NETRN20_8: RN20.8 SW77.2 U10.3(D4)
NETRN21_5: RN21.5 SW84.2 U11.14(D3)
NETRN21_6: RN21.6 SW83.2 U11.13(D2)
NETRN21_7: RN21.7 SW82.2 U11.12(D1)
NETRN21_8: RN21.8 SW81.2 U11.11(D0)
NETRN22_5: RN22.5 U11.6(D7)
NETRN22_6: RN22.6 U11.5(D6)
NETRN22_7: RN22.7 U11.4(D5)
NETU1_10: U1.10(DS) U2.9(Q7)
NETU2_10: U2.10(DS) U3.9(Q7)
NETU3_10: U3.10(DS) U4.9(Q7)
NETU4_10: U4.10(DS) U5.9(Q7)
NETU5_10: U5.10(DS) U6.9(Q7)
NETU6_10: U6.10(DS) U7.9(Q7)
NETU7_10: U7.10(DS) U8.9(Q7)
NETU8_10: U8.10(DS) U9.9(Q7)
NETU9_10: U9.10(DS) U10.9(Q7)
NETU10_10: U10.10(DS) U11.9(Q7)

Not connected (* = marked no-connect by the designer): FPC1 21 22 23 24 25 26 27 28 29 30 31 32 33 34 35 36 37 38; FPC2 14 15 16 17 18; FPC3 3 4 5 6 7; U2 7(~Q7~)*; U3 7(~Q7~)*; U4 7(~Q7~)*; U5 7(~Q7~)*; U6 7(~Q7~)*; U7 7(~Q7~)*; U8 7(~Q7~)*; U9 7(~Q7~)*; U10 7(~Q7~)*; U11 7(~Q7~)*

## Notes on the sheets
sheet 1
- Keys
